# EasyEDA schematic Sch-version1.0.json
TITLE: ULTRASOUND_IMAGING_JHZ; REV: 1.0; Date: 2023-01-04; Sheet: 1/1; Company: SCU_JHZ
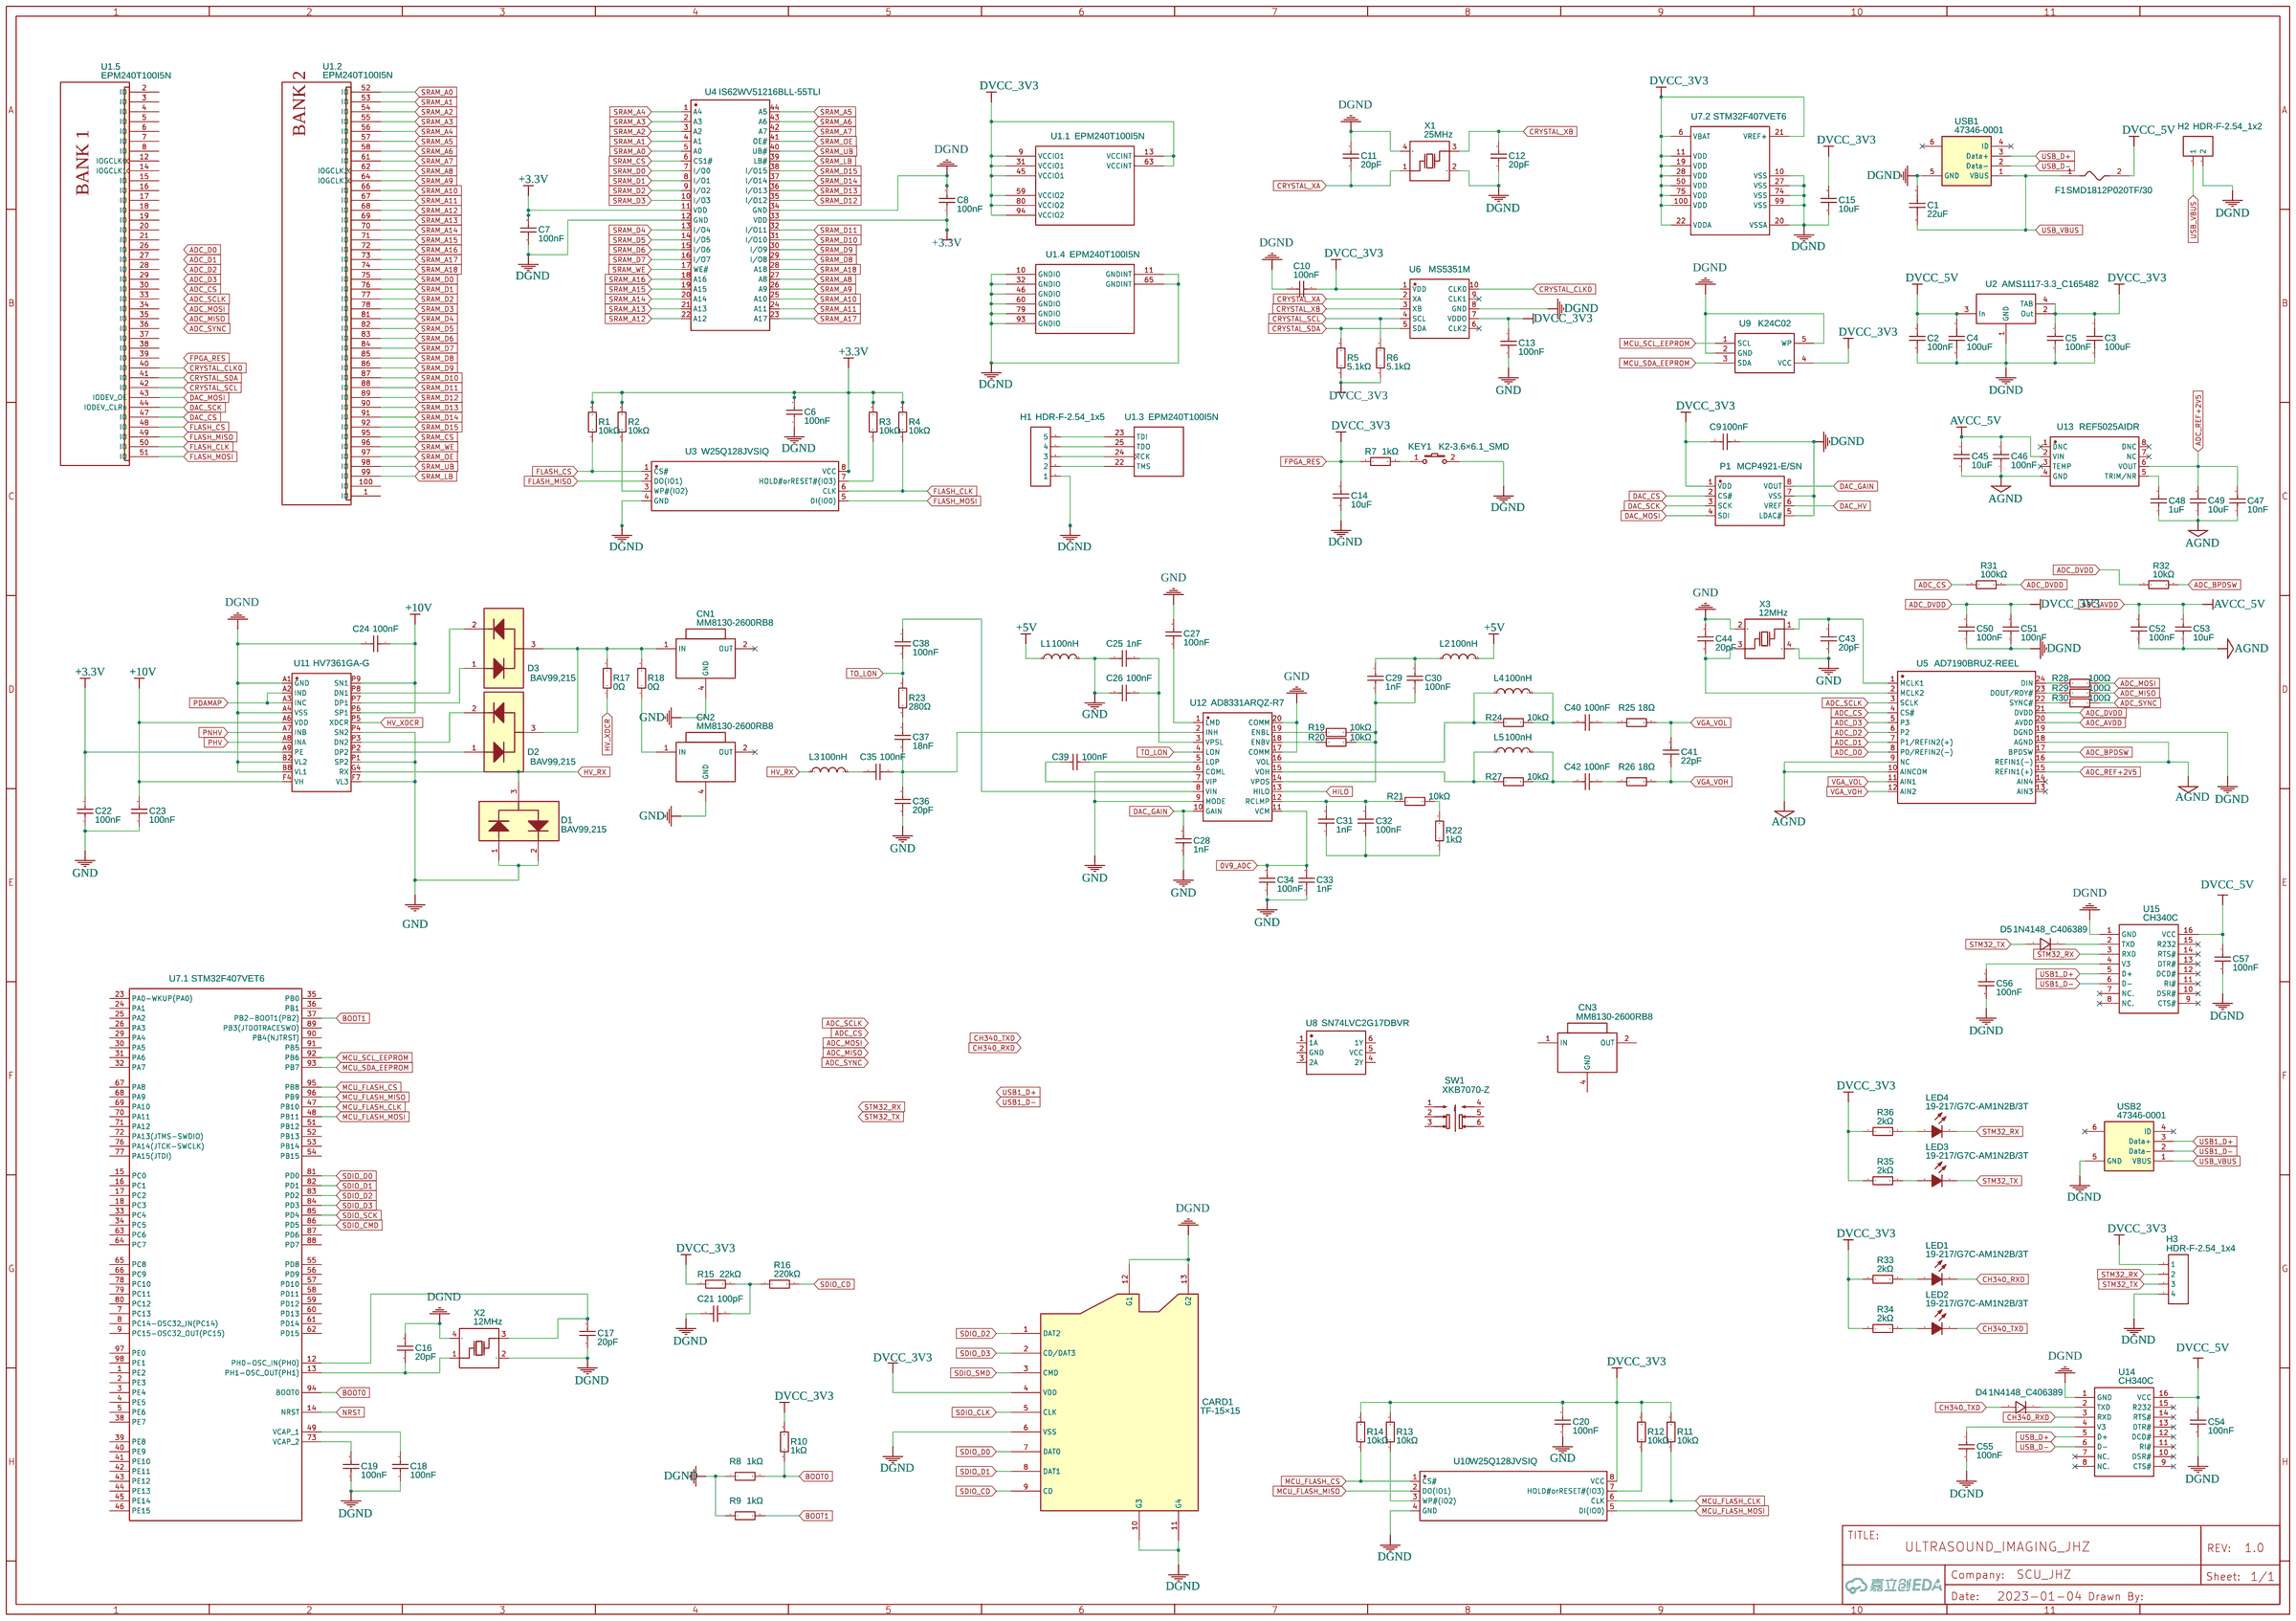
[diagram p0: schematic sheet]

## Parts
C1  22uF  [C0805]
C2  100nF  [C0603]
C3  100uF  [C1206]
C4  100uF  [C1206]
C5  100nF  [C0603]
C6  100nF  [C0603]
C7  100nF  [C0603]
C8  100nF  [C0603]
C9  100nF  [C0603]
C10  100nF  [C0603]
C11  20pF  [C0402]
C12  20pF  [C0402]
C13  100nF  [C0603]
C14  10uF  [C0805]
C15  10uF  [C0805]
C16  20pF  [C0402]
C17  20pF  [C0402]
C18  100nF  [C0603]
C19  100nF  [C0603]
C20  100nF  [C0603]
C21  100pF  [C0402]
C22  100nF  [C0603]
C23  100nF  [C0603]
C24  100nF  [C0603]
C25  1nF  [C1206]
C26  100nF  [C0603]
C27  100nF  [C0603]
C28  1nF  [C1206]
C29  1nF  [C1206]
C30  100nF  [C0603]
C31  1nF  [C1206]
C32  100nF  [C0603]
C33  1nF  [C1206]
C34  100nF  [C0603]
C35  100nF  [C0603]
C36  20pF  [C0402]
C37  18nF  [C0805]
C38  100nF  [C0603]
C39  100nF  [C0603]
C40  100nF  [C0603]
C41  22pF  [C0402]
C42  100nF  [C0603]
C43  20pF  [C0402]
C44  20pF  [C0402]
C45  10uF  [C0805]
C46  100nF  [C0603]
C47  10nF  [C0603]
C48  1uF  [C0603]
C49  10uF  [C0805]
C50  100nF  [C0603]
C51  100nF  [C0603]
C52  100nF  [C0603]
C53  10uF  [C0805]
C54  100nF  [C0603]
C55  100nF  [C0603]
C56  100nF  [C0603]
C57  100nF  [C0603]
CARD1  TF-15×15  [TF-SMD_TF-15-15]
CN1  MM8130-2600RB8  [ANT-SMD_MM8130-2600RB8]
CN2  MM8130-2600RB8  [ANT-SMD_MM8130-2600RB8]
CN3  MM8130-2600RB8  [ANT-SMD_MM8130-2600RB8]
D1  BAV99,215  [SOT-23-3_L2.9-W1.6-P1.90-LS2.8-BR]
D2  BAV99,215  [SOT-23-3_L2.9-W1.6-P1.90-LS2.8-BR]
D3  BAV99,215  [SOT-23-3_L2.9-W1.6-P1.90-LS2.8-BR]
D4  1N4148_C406389  [DO-35_BD2.0-L4.2-P8.20-D0.5-RD]
D5  1N4148_C406389  [DO-35_BD2.0-L4.2-P8.20-D0.5-RD]
F1  SMD1812P020TF/30  [F1812]
H1  HDR-F-2.54_1x5  [HDR-F-2.54_1X5]
H2  HDR-F-2.54_1x2  [HDR-F-2.54_1X2]
H3  HDR-F-2.54_1x4  [HDR-F-2.54_1X4]
KEY1  K2-3.6×6.1_SMD  [KEY-SMD_2P-L6.2-W3.6-LS8.0]
L1  100nH  [L0603]
L2  100nH  [L0603]
L3  100nH  [L0603]
L4  100nH  [L0603]
L5  100nH  [L0603]
LED1  19-217/G7C-AM1N2B/3T  [LED0603-R-RD]
LED2  19-217/G7C-AM1N2B/3T  [LED0603-R-RD]
LED3  19-217/G7C-AM1N2B/3T  [LED0603-R-RD]
LED4  19-217/G7C-AM1N2B/3T  [LED0603-R-RD]
P1  MCP4921-E/SN  [SOP-8_L4.9-W3.9-P1.27-LS6.0-BL]
R1  10kΩ  [R0603]
R2  10kΩ  [R0603]
R3  10kΩ  [R0603]
R4  10kΩ  [R0603]
R5  5.1kΩ  [R0603]
R6  5.1kΩ  [R0603]
R7  1kΩ  [R0603]
R8  1kΩ  [R0603]
R9  1kΩ  [R0603]
R10  1kΩ  [R0603]
R11  10kΩ  [R0603]
R12  10kΩ  [R0603]
R13  10kΩ  [R0603]
R14  10kΩ  [R0603]
R15  22kΩ  [R0402]
R16  220kΩ  [R0603]
R17  0Ω  [R0603]
R18  0Ω  [R0603]
R19  10kΩ  [R0603]
R20  10kΩ  [R0603]
R21  10kΩ  [R0603]
R22  1kΩ  [R0603]
R23  280Ω  [R0402]
R24  10kΩ  [R0603]
R25  18Ω  [R0603]
R26  18Ω  [R0603]
R27  10kΩ  [R0603]
R28  100Ω  [R0603]
R29  100Ω  [R0603]
R30  100Ω  [R0603]
R31  100kΩ  [R0402]
R32  10kΩ  [R0603]
R33  2kΩ  [R0603]
R34  2kΩ  [R0603]
R35  2kΩ  [R0603]
R36  2kΩ  [R0603]
SW1  XKB7070-Z  [SW-TH_6P-L7.0-W7.0-P2.00]
U1  EPM240T100I5N  [TQFP-100_L14.0-W14.0-P0.50-LS16.0-BL]  (sections 1,2,3,4,5)
U2  AMS1117-3.3_C165482  [SOT-223_L6.5-W3.5-P2.30-LS7.0-BR]
U3  W25Q128JVSIQ  [SOIC-8_L5.3-W5.3-P1.27-LS8.0-BL]
U4  IS62WV51216BLL-55TLI  [TSOP-44_L18.4-W10.2-P0.80-LS11.8-BL]
U5  AD7190BRUZ-REEL  [TSSOP-24_L7.8-W4.4-P0.65-LS6.4-BL]
U6  MS5351M  [MSOP-10_L3.0-W3.0-P0.50-LS5.0-BL]
U7  STM32F407VET6  [LQFP-100_L14.0-W14.0-P0.50-LS16.0-BL]  (sections 1,2)
U8  SN74LVC2G17DBVR  [SOT-23-6_L2.9-W1.6-P0.95-LS2.8-BR]
U9  K24C02  [SOT-23-5_L3.0-W1.7-P0.95-LS2.8-BR]
U10  W25Q128JVSIQ  [SOIC-8_L5.3-W5.3-P1.27-LS8.0-BL]
U11  HV7361GA-G  [CABGA-22_L5.0-W7.0-TL-HV7361GA-G]
U12  AD8331ARQZ-R7  [QSOP-20_L8.7-W3.9-P0.64-LS6.0-BL]
U13  REF5025AIDR  [SOIC-8_L4.9-W3.9-P1.27-LS6.0-BL]
U14  CH340C  [SOP-16_L10.0-W3.9-P1.27-LS6.0-BL]
U15  CH340C  [SOP-16_L10.0-W3.9-P1.27-LS6.0-BL]
USB1  47346-0001  [MICRO-USB-SMD_47346-0001]
USB2  47346-0001  [MICRO-USB-SMD_47346-0001]
X1  25MHz  [OSC-SMD_4P-L3.2-W2.5-BL]
X2  12MHz  [OSC-SMD_4P-L3.2-W2.5-BL]
X3  12MHz  [OSC-SMD_4P-L3.2-W2.5-BL]

## Library data of the parts
C1 = 0805X226M160NT: Supplier: LCSC; Manufacturer: FH(风华); Contributor: LCSC; Supplier Part: C129302; JLCPCB Part Class: Extended Part
C2 C5-C10 C13 C18-C20 C22-C24 C26 C27 C30 C32 C34 C35 C38-C40 C42 C46 C50-C52 C54-C57 = 0603B104K500NT: Supplier: LCSC; Manufacturer: FH(风华); Supplier Part: C30926; JLCPCB Part Class: Extended Part
C3 C4 = 1206X107M6R3NT: Supplier: LCSC; Manufacturer: FH(风华); Contributor: LCSC; Supplier Part: C178304; JLCPCB Part Class: Extended Part
C11 C12 C16 C17 C36 C43 C44 = 0402CG200J500NT: Supplier: LCSC; Manufacturer: FH(风华); Supplier Part: C1554; JLCPCB Part Class: Basic Part
C14 C15 C45 C49 C53 = 0805X106K250NT: Supplier: LCSC; Manufacturer: FH(风华); Supplier Part: C40894; JLCPCB Part Class: Extended Part
C21 = 0402CG101J500NT: Supplier: LCSC; Manufacturer: FH(风华); Supplier Part: C1546; JLCPCB Part Class: Basic Part
C25 C28 C29 C31 C33 = 1206B102K202NT: Supplier: LCSC; Manufacturer: FH(风华); Supplier Part: C9196; JLCPCB Part Class: Basic Part
C37 = 0805B183K500NT: Supplier: LCSC; Manufacturer: FH(风华); Supplier Part: C1723; JLCPCB Part Class: Extended Part
C41 = 0402CG220J500NT: Supplier: LCSC; Manufacturer: FH(风华); Supplier Part: C1555; JLCPCB Part Class: Basic Part
C47 = 0603B103K500NT: Supplier: LCSC; Manufacturer: FH(风华); Supplier Part: C57112; JLCPCB Part Class: Basic Part
C48 = 0603B105K250NT: Supplier: LCSC; Manufacturer: FH(风华); Supplier Part: C59302; JLCPCB Part Class: Extended Part
CARD1 = TF-15×15: Supplier: LCSC; Manufacturer: SOFNG(硕方); Manufacturer Part: TF-15x15; Supplier Part: C111196; JLCPCB Part Class: Extended Part
CN1-CN3 = MM8130-2600RB8: Supplier: LCSC; Manufacturer: muRata(村田); Supplier Part: C91633; JLCPCB Part Class: Extended Part
D1-D3 = BAV99,215: Supplier: LCSC; Manufacturer: Nexperia(安世); Supplier Part: C2500; JLCPCB Part Class: Basic Part
D4 D5 = 1N4148_C406389: Supplier: LCSC; Supplier Part: C406389; Manufacturer: GOOD-ARK(固锝); Manufacturer Part: 1N4148; Contributor: LCSC; JLCPCB Part Class: Extended Part
F1 = SMD1812P020TF/30: Supplier: LCSC; Manufacturer: RUILON(瑞隆源); Supplier Part: C13575; JLCPCB Part Class: Extended Part
H1 = HDR-F-2.54_1x5: Supplier Part: C50950; Supplier: LCSC; Contributor: LCEDA_Lib
H2 = HDR-F-2.54_1x2: Supplier Part: C49661; Supplier: LCSC; Contributor: LCEDA_Lib
H3 = HDR-F-2.54_1x4: Supplier Part: C225501; Supplier: LCSC; Contributor: LCEDA_Lib
KEY1 = K2-3.6×6.1_SMD: Supplier Part: C118141; Supplier: LCSC; Manufacturer Part: K2-1107ST-A4SW-06; Contributor: LCEDA_Lib; 制造商: 韩国韩荣
L1-L5 = VHF160808HR10JT: Supplier: LCSC; Manufacturer: FH(风华); Supplier Part: C90214; JLCPCB Part Class: Extended Part
LED1-LED4 = 19-217/G7C-AM1N2B/3T: Supplier: LCSC; Supplier Part: C183844; Manufacturer: EVERLIGHT(亿光); Contributor: LCSC; JLCPCB Part Class: Extended Part
P1 = MCP4921-E/SN: Supplier: LCSC; Manufacturer: MICROCHIP(美国微芯); Supplier Part: C43499; JLCPCB Part Class: Extended Part
R1-R4 R11-R14 R19-R21 R24 R27 R32 = RS-03K1002FT: Supplier: LCSC; Supplier Part: C115324; Manufacturer: FH(风华); Resistance (Ohms): 10K; Contributor: LCSC; JLCPCB Part Class: Extended Part
R5 R6 = RS-03K5101FT: Supplier: LCSC; Supplier Part: C156350; Manufacturer: FH(风华); Resistance (Ohms): 5.1K; Contributor: LCSC; JLCPCB Part Class: Extended Part
R7-R10 R22 = RS-03K1001FT: Supplier: LCSC; Manufacturer: FH(风华); Supplier Part: C115325; Resistance (Ohms): 1K; JLCPCB Part Class: Extended Part
R15 = RC-02W2202FT: Supplier: LCSC; Supplier Part: C258097; Manufacturer: FH(风华); Resistance (Ohms): 22K; Contributor: LCSC; JLCPCB Part Class: Extended Part
R16 = RS-03K2203FT: Supplier: LCSC; Supplier Part: C304719; Manufacturer: FH(风华); Resistance (Ohms): 220K; Contributor: LCSC; JLCPCB Part Class: Extended Part
R17 R18 = RS-03000JT_C115304: Supplier: LCSC; Supplier Part: C115304; Manufacturer: FH(风华); Manufacturer Part: RS-03000JT; Resistance (Ohms): 0; Contributor: LCSC; JLCPCB Part Class: Extended Part
R23 = RC-02W2800FT: Supplier: LCSC; Supplier Part: C321421; Manufacturer: FH(风华); Resistance (Ohms): 280; Contributor: LCSC; JLCPCB Part Class: Extended Part
R25 R26 = RS-03K180JT: Supplier: LCSC; Supplier Part: C286576; Manufacturer: FH(风华); Resistance (Ohms): 18; Contributor: LCSC; JLCPCB Part Class: Extended Part
R28-R30 = RS-03K101JT: Supplier: LCSC; Manufacturer: FH(风华); Supplier Part: C86983; Resistance (Ohms): 100; JLCPCB Part Class: Extended Part
R31 = RC-02W1003FT: Supplier: LCSC; Supplier Part: C258090; Manufacturer: FH(风华); Resistance (Ohms): 100K; Contributor: LCSC; JLCPCB Part Class: Extended Part
R33-R36 = RS-03K2001FT: Supplier: LCSC; Manufacturer: FH(风华); Supplier Part: C115336; Resistance (Ohms): 2K; JLCPCB Part Class: Extended Part
SW1 = XKB7070-Z: Supplier: LCSC; Supplier Part: C318863; Manufacturer: XKB Enterprise; Contributor: LCSC; JLCPCB Part Class: Extended Part
U1 = EPM240T100I5N: Supplier Part: C40067; Supplier: LCSC; Manufacturer: Intel/Altera; subpart_no: 2; JLCPCB Part Class: Extended Part
U2 = AMS1117-3.3_C165482: Supplier: LCSC; Supplier Part: C165482; Manufacturer: SHIKUES(时科); Manufacturer Part: SK1117-3.3; Contributor: LCSC; JLCPCB Part Class: Extended Part
U3 U10 = W25Q128JVSIQ: Supplier: LCSC; Supplier Part: C113767; Manufacturer: WINBOND(华邦); Contributor: LCSC; JLCPCB Part Class: Extended Part
U4 = IS62WV51216BLL-55TLI: Supplier: LCSC; Manufacturer: ISSI(美国芯成); Supplier Part: C11315; JLCPCB Part Class: Extended Part
U5 = AD7190BRUZ-REEL: Supplier: LCSC; Manufacturer: ADI(亚德诺)/LINEAR(凌特); Supplier Part: C19566; JLCPCB Part Class: Extended Part
U6 = MS5351M: Supplier: LCSC; Supplier Part: C1509083; Manufacturer: 杭州瑞盟; Contributor: LCSC; JLCPCB Part Class: Extended Part
U7 = STM32F407VET6: tags: STM32; Supplier Part: C28730; Supplier: LCSC; Manufacturer: ST(意法半导体); subpart_no: 1; image: http://image.lceda.cn/szlcsc/C28730.jpg; JLCPCB Part Class: Extended Part
U8 = SN74LVC2G17DBVR: Supplier: LCSC; Manufacturer: TI(德州仪器); Supplier Part: C10429; JLCPCB Part Class: Extended Part
U9 = K24C02: Supplier: LCSC; Manufacturer: 华虹宏力; Supplier Part: C84964; JLCPCB Part Class: Extended Part
U11 = HV7361GA-G: Supplier: LCSC; Supplier Part: C633420; Manufacturer: MICROCHIP(美国微芯); Contributor: LCSC; JLCPCB Part Class: Extended Part
U12 = AD8331ARQZ-R7: Supplier: LCSC; Supplier Part: C578697; Manufacturer: ADI(亚德诺)/LINEAR(凌特); Contributor: LCSC; JLCPCB Part Class: Extended Part
U13 = REF5025AIDR: tags: Voltage Reference; Supplier Part: C11341; Supplier: LCSC; Manufacturer: TI(德州仪器); subpart_no: 2; JLCPCB Part Class: Extended Part
U14 U15 = CH340C: Supplier: LCSC; Manufacturer: WCH(南京沁恒); Supplier Part: C84681; JLCPCB Part Class: Extended Part
USB1 USB2 = 47346-0001: Supplier: LCSC; Supplier Part: C132560; Manufacturer: MOLEX; Manufacturer Part: 473460001; Contributor: LCSC; JLCPCB Part Class: Extended Part
X1 = X322525MOB4SI: Supplier: LCSC; Manufacturer: YXC(扬兴晶振); Supplier Part: C9006; JLCPCB Part Class: Basic Part
X2 X3 = X322512MSB4SI: Supplier: LCSC; Manufacturer: YXC(扬兴晶振); Supplier Part: C9002; JLCPCB Part Class: Basic Part

## Nets
0V9_ADC: C33.1 C34.1 U12.11(VCM)
+3.3V: C6.2 C7.2 C8.1 C22.2 R1.2 R2.2 R3.2 R4.2 U3.8(VCC) U4.11(VDD) U4.33(VDD) U11.A9(PE)
+5V: L1.1 L2.2
+10V: C23.2 C24.1 U11.A6(VDD) U11.F4(VH) U11.P6(SP1) U11.P9(SN1)
AGND: C45.1 C46.1 C47.1 C48.1 C49.1 C52.1 C53.1 U5.9(NC) U5.10(AINCOM) U5.16(REFIN1(-)) U5.18(AGND) U13.4(GND)
DGND: C1.1 C2.1 C3.2 C4.2 C5.1 C6.1 C7.1 C8.2 C9.1 C10.1 C11.2 C12.1 C14.1 C15.1 C16.2 C17.1 C18.1 C19.1 C21.1 C24.2 C50.1 C51.1 C54.2 C55.2 C56.2 C57.2 CARD1.6(VSS) CARD1.10(G3) CARD1.11(G4) CARD1.12(G1) CARD1.13(G2) H1.1 H2.2 H3.4 KEY1.2 P1.5(LDAC#) P1.7(VSS) R8.1 R9.1 U1.10(GNDIO) U1.11(GNDINT) U1.32(GNDIO) U1.46(GNDIO) U1.60(GNDIO) U1.65(GNDINT) U1.79(GNDIO) U1.93(GNDIO) U2.1(GND) U3.4(GND) U4.12(GND) U4.34(GND) U5.19(DGND) U6.8(GND) U7.10(VSS) U7.20(VSSA) U7.27(VSS) U7.74(VSS) U7.99(VSS) U9.2(GND) U9.5(WP) U10.4(GND) U11.A1(GND) U11.A4(VSS) U11.B2(VL2) U11.B8(VL1) U14.1(GND) U15.1(GND) USB1.5(GND) USB2.5(GND) X1.2(GND) X1.4(GND) X2.2(GND) X2.4(GND)
DVCC_5V: C2.2 C4.1 C54.1 C57.1 F1.2 U2.3(In) U14.16(VCC) U15.16(VCC)
GND: C13.1 C20.1 C22.1 C23.1 C25.1 C26.1 C27.2 C28.1 C33.2 C34.2 C36.1 C43.2 C44.1 CN1.4(GND) CN2.4(GND) D1.1 D1.2 L1.2 U11.F7(VL3) U11.P1(SP2) U11.P4(SN2) U12.6(COML) U12.9(MODE) U12.17(COMM) U12.20(COMM) X3.2(GND) X3.4(GND)
ADC_AVDD: C45.2 C46.2 C52.2 C53.2 U5.20(AVDD) U13.2(VIN)
ADC_BPDSW: R32.2 U5.17(BPDSW)
ADC_CS: R31.1 U5.4(CS#)
ADC_D0: U5.8(P0/REFIN2(-))
ADC_D1: U5.7(P1/REFIN2(+))
ADC_D2: U5.6(P2)
ADC_D3: U5.5(P3)
ADC_DVDD: C3.1 C5.2 C9.2 C10.2 C13.2 C14.2 C15.2 C20.2 C50.2 C51.2 CARD1.4(VDD) H3.1 P1.1(VDD) R5.1 R6.1 R7.1 R10.2 R11.2 R12.2 R13.2 R14.2 R15.1 R31.2 R32.1 R33.1 R34.1 R35.1 R36.1 U1.9(VCCIO1) U1.13(VCCINT) U1.31(VCCIO1) U1.45(VCCIO1) U1.59(VCCIO2) U1.63(VCCINT) U1.80(VCCIO2) U1.94(VCCIO2) U2.2(Out) U2.4(TAB) U5.21(DVDD) U6.1(VDD) U6.7(VDDO) U7.6(VBAT) U7.11(VDD) U7.19(VDD) U7.21(VREF+) U7.22(VDDA) U7.28(VDD) U7.50(VDD) U7.75(VDD) U7.100(VDD) U9.4(VCC) U10.8(VCC)
ADC_MISO: R29.2
ADC_MOSI: R28.2
ADC_REF+2V5: C47.2 C49.2 U5.15(REFIN1(+)) U13.6(VOUT)
ADC_SCLK: U5.3(SCLK)
ADC_SYNC: R30.2
BOOT0: R8.2 R10.1 U7.94(BOOT0)
BOOT1: R9.2 U7.37(PB2-BOOT1(PB2))
CH340_RXD: LED1.2(C) U14.3(RXD)
CH340_TXD: D4.2(A) LED2.2(C)
CRYSTAL_CLK0: U1.40(IO) U6.10(CLK0)
CRYSTAL_SCL: R6.2 U1.42(IO) U6.4(SCL)
CRYSTAL_SDA: R5.2 U1.41(IO) U6.5(SDA)
CRYSTAL_XA: C11.1 U6.2(XA) X1.1(OSC1)
CRYSTAL_XB: C12.2 U6.3(XB) X1.3(OSC2)
DAC_CS: P1.2(CS#) U1.47(IO)
DAC_GAIN: C28.2 P1.8(VOUT) U12.10(GAIN)
DAC_HV: P1.6(VREF)
DAC_MOSI: P1.4(SDI) U1.43(IODEV_OE)
DAC_SCK: P1.3(SCK) U1.44(IODEV_CLRn)
FLASH_CLK: R4.1 U1.50(IO) U3.6(CLK)
FLASH_CS: R1.1 U1.48(IO) U3.1(CS#)
FLASH_MISO: U1.49(IO) U3.2(DO(IO1))
FLASH_MOSI: U1.51(IO) U3.5(DI(IO0))
HILO: U12.13(HILO)
HV_RX: D1.3 L3.1 U11.G4(RX)
HV_XDCR: R17.1 U11.P5(XDCR)
MCU_FLASH_CLK: R11.1 U7.47(PB10) U10.6(CLK)
MCU_FLASH_CS: R14.1 U7.95(PB8) U10.1(CS#)
MCU_FLASH_MISO: U7.96(PB9) U10.2(DO(IO1))
MCU_FLASH_MOSI: U7.48(PB11) U10.5(DI(IO0))
MCU_SCL_EEPROM: U7.92(PB6) U9.1(SCL)
MCU_SDA_EEPROM: U7.93(PB7) U9.3(SDA)
NRST: U7.14(NRST)
PDAMAP: U11.A2(IND) U11.A3(INC)
PHV: U11.A8(INA)
PNHV: U11.A7(INB)
SDIO_CD: CARD1.9(CD) R16.2
SDIO_CLK: CARD1.5(CLK)
SDIO_CMD: U7.86(PD5)
SDIO_D0: CARD1.7(DAT0) U7.81(PD0)
SDIO_D1: CARD1.8(DAT1) U7.82(PD1)
SDIO_D2: CARD1.1(DAT2) U7.83(PD2)
SDIO_D3: CARD1.2(CD/DAT3) U7.84(PD3)
SDIO_SCK: U7.85(PD4)
SDIO_SMD: CARD1.3(CMD)
SRAM_A0: U1.52(IO) U4.5(A0)
SRAM_A1: U1.53(IO) U4.4(A1)
SRAM_A2: U1.54(IO) U4.3(A2)
SRAM_A3: U1.55(IO) U4.2(A3)
SRAM_A4: U1.56(IO) U4.1(A4)
SRAM_A5: U1.57(IO) U4.44(A5)
SRAM_A6: U1.58(IO) U4.43(A6)
SRAM_A7: U1.61(IO) U4.42(A7)
SRAM_A8: U1.62(IOGCLK2) U4.27(A8)
SRAM_A9: U1.64(IOGCLK3) U4.26(A9)
SRAM_A10: U1.66(IO) U4.25(A10)
SRAM_A11: U1.67(IO) U4.24(A11)
SRAM_A12: U1.68(IO) U4.22(A12)
SRAM_A13: U1.69(IO) U4.21(A13)
SRAM_A14: U1.70(IO) U4.20(A14)
SRAM_A15: U1.71(IO) U4.19(A15)
SRAM_A16: U1.72(IO) U4.18(A16)
SRAM_A17: U1.73(IO) U4.23(A17)
SRAM_A18: U1.74(IO) U4.28(A18)
SRAM_CS: U1.95(IO) U4.6(CS1#)
SRAM_D0: U1.75(IO) U4.7(I/O0)
SRAM_D1: U1.76(IO) U4.8(I/O1)
SRAM_D2: U1.77(IO) U4.9(I/O2)
SRAM_D3: U1.78(IO) U4.10(I/O3)
SRAM_D4: U1.81(IO) U4.13(I/O4)
SRAM_D5: U1.82(IO) U4.14(I/O5)
SRAM_D6: U1.83(IO) U4.15(I/O6)
SRAM_D7: U1.84(IO) U4.16(I/O7)
SRAM_D8: U1.85(IO) U4.29(I/O8)
SRAM_D9: U1.86(IO) U4.30(I/O9)
SRAM_D10: U1.87(IO) U4.31(I/O10)
SRAM_D11: U1.88(IO) U4.32(I/O11)
SRAM_D12: U1.89(IO) U4.35(I/O12)
SRAM_D13: U1.90(IO) U4.36(I/O13)
SRAM_D14: U1.91(IO) U4.37(I/O14)
SRAM_D15: U1.92(IO) U4.38(I/O15)
SRAM_LB: U1.99(IO) U4.39(LB#)
SRAM_OE: U1.97(IO) U4.41(OE#)
SRAM_UB: U1.98(IO) U4.40(UB#)
SRAM_WE: U1.96(IO) U4.17(WE#)
STM32_RX: H3.2 LED4.2(C) U15.3(RXD)
STM32_TX: D5.2(A) H3.3 LED3.2(C)
TO_LON: C38.1 R23.2 U12.4(LON)
USB1_D+: U15.5(D+) USB2.3(Data+)
USB1_D-: U15.6(D-) USB2.2(Data-)
USB_D+: U14.5(D+) USB1.3(Data+)
USB_D-: U14.6(D-) USB1.2(Data-)
USB_VBUS: C1.2 F1.1 H2.1 USB1.1(VBUS) USB2.1(VBUS)
VGA_VOH: C41.1 R26.2 U5.12(AIN2)
VGA_VOL: C41.2 R25.2 U5.11(AIN1)
Net-(C16-1): C16.1 U7.13(PH1-OSC_OUT(PH1)) X2.1(OSC1)
Net-(C17-2): C17.2 U7.12(PH0-OSC_IN(PH0)) X2.3(OSC2)
Net-(C18-2): C18.2 U7.49(VCAP_1)
Net-(C19-2): C19.2 U7.73(VCAP_2)
Net-(C21-2): C21.2 R15.2 R16.1
Net-(C25-2): C25.2 C26.2 U12.3(VPSL)
Net-(C27-1): C27.1 U12.1(LMD)
Net-(C29-1): C29.1 C30.1 R19.2 R20.2 U12.14(VPOS)
Net-(C29-2): C29.2 C30.2 L2.1
Net-(C31-1): C31.1 C32.1 R22.1
Net-(C31-2): C31.2 C32.2 R21.1 U12.12(RCLMP)
Net-(C35-1): C35.1 L3.2
Net-(C35-2): C35.2 C36.2 C37.1 U12.2(INH)
Net-(C37-2): C37.2 R23.1
Net-(C38-2): C38.2 U12.8(VIN)
Net-(C39-1): C39.1 U12.7(VIP)
Net-(C39-2): C39.2 U12.5(LOP)
Net-(C40-1): C40.1 R25.1
Net-(C40-2): C40.2 L4.2 R24.2
Net-(C42-1): C42.1 R26.1
Net-(C42-2): C42.2 L5.2 R27.2
Net-(C43-1): C43.1 U5.1(MCLK1) X3.1(OSC1)
Net-(C44-2): C44.2 U5.2(MCLK2) X3.3(OSC2)
Net-(C48-2): C48.2 U13.5(TRIM/NR)
Net-(C55-1): C55.1 U14.4(V3)
Net-(C56-1): C56.1 U15.4(V3)
Net-(CN1-1): CN1.1(IN) D2.3 D3.3 R17.2 R18.2
Net-(CN2-1): CN2.1(IN) R18.1
Net-(D2-1): D2.1 U11.P2(DP2)
Net-(D2-2): D2.2 U11.P3(DN2)
Net-(D3-1): D3.1 U11.P7(DP1)
Net-(D3-2): D3.2 U11.P8(DN1)
Net-(D4-1): D4.1(C) U14.2(TXD)
Net-(D5-1): D5.1(C) U15.2(TXD)
Net-(H1-2): H1.2 U1.22(TMS)
Net-(H1-3): H1.3 U1.24(TCK)
Net-(H1-4): H1.4 U1.25(TDO)
Net-(H1-5): H1.5 U1.23(TDI)
Net-(KEY1-1): KEY1.1 R7.2
Net-(L4-1): L4.1 R24.1 U12.16(VOL)
Net-(L5-1): L5.1 R27.1 U12.15(VOH)
Net-(LED1-1): LED1.1(A) R33.2
Net-(LED2-1): LED2.1(A) R34.2
Net-(LED3-1): LED3.1(A) R35.2
Net-(LED4-1): LED4.1(A) R36.2
Net-(R2-1): R2.1 U3.3(WP#(IO2))
Net-(R3-1): R3.1 U3.7(HOLD#orRESET#(IO3))
Net-(R12-1): R12.1 U10.7(HOLD#orRESET#(IO3))
Net-(R13-1): R13.1 U10.3(WP#(IO2))
Net-(R19-1): R19.1 U12.19(ENBL)
Net-(R20-1): R20.1 U12.18(ENBV)
Net-(R21-2): R21.2 R22.2
Net-(R28-1): R28.1 U5.24(DIN)
Net-(R29-1): R29.1 U5.23(DOUT/RDY#)
Net-(R30-1): R30.1 U5.22(SYNC#)

Not connected (* = marked no-connect by the designer): CN1 2(OUT)*; CN2 2(OUT)*; CN3 1(IN) 2(OUT) 4(GND); SW1 1 2 3 4 5 6; U1 1(IO) 2(IO) 3(IO) 4(IO) 5(IO) 6(IO) 7(IO) 8(IO) 12(IOGCLK0) 14(IOGCLK1) 15(IO) 16(IO) 17(IO) 18(IO) 19(IO) 20(IO) 21(IO) 26(IO) 27(IO) 28(IO) 29(IO) 30(IO) 33(IO) 34(IO) 35(IO) 36(IO) 37(IO) 38(IO) 39(IO) 100(IO); U5 13(AIN3)* 14(AIN4)*; U6 6(CLK2)* 9(CLK1)*; U7 1(PE2) 2(PE3) 3(PE4) 4(PE5) 5(PE6) 7(PC13) 8(PC14-OSC32_IN(PC14)) 9(PC15-OSC32_OUT(PC15)) 15(PC0) 16(PC1) 17(PC2) 18(PC3) 23(PA0-WKUP(PA0)) 24(PA1) 25(PA2) 26(PA3) 29(PA4) 30(PA5) 31(PA6) 32(PA7) 33(PC4) 34(PC5) 35(PB0) 36(PB1) 38(PE7) 39(PE8) 40(PE9) 41(PE10) 42(PE11) 43(PE12) 44(PE13) 45(PE14) 46(PE15) 51(PB12) 52(PB13) 53(PB14) 54(PB15) 55(PD8) 56(PD9) 57(PD10) 58(PD11) 59(PD12) 60(PD13) 61(PD14) 62(PD15) 63(PC6) 64(PC7) 65(PC8) 66(PC9) 67(PA8) 68(PA9) 69(PA10) 70(PA11) 71(PA12) 72(PA13(JTMS-SWDIO)) 76(PA14(JTCK-SWCLK)) 77(PA15(JTDI)) 78(PC10) 79(PC11) 80(PC12) 87(PD6) 88(PD7) 89(PB3(JTDOTRACESWO)) 90(PB4(NJTRST)) 91(PB5) 97(PE0) 98(PE1); U8 1(1A) 2(GND) 3(2A) 4(2Y) 5(VCC) 6(1Y); U13 1(DNC)* 3(TEMP)* 7(NC)* 8(DNC)*; U14 7(NC.)* 8(NC.)* 9(CTS#)* 10(DSR#)* 11(RI#)* 12(DCD#)* 13(DTR#)* 14(RTS#)* 15(R232)*; U15 7(NC.)* 8(NC.)* 9(CTS#)* 10(DSR#)* 11(RI#)* 12(DCD#)* 13(DTR#)* 14(RTS#)* 15(R232)*; USB1 4(ID)* 6*; USB2 4(ID)* 6*
